# EAGLE design adapter-board-controller (EAGLE 7.6.0)
ADAPTER-BOARD-CONTROLLER
AUTHOR: lokies; COMPANY: Max-Planck-Institut für Gravitationsphysik; CREATIONAUTHOR: lokies; CREATIONDATE: 2026-02-05; INFOSETTINGS: Used by 'info.ulp' - do not edit manually! |FileTime=2026-02-05, 14:04:26|FileVersion=2||[FrontMatter]|DocTitle=|SubTitle=|Authors=|Keywords=|Abstract=|LaTeXSyntax=0||[Safety]|VoltageHazard=-1|HeatHazard=-1|Convection=0|ForcedAir=0|WaterCooling=0|LightHazard=-1|LaserPower=1000|LaserWavelength=1064|LaserClass=6|LightPower=1000|LightInvisible=0||[Notes]|Machinery=-1|IntendedUsers=-1|; REVISION: 2026-02-05; TITLE: ADAPTER-BOARD-CONTROLLER; TITLE1: ADAPTER-BOARD-; TITLE2: CONTROLLER
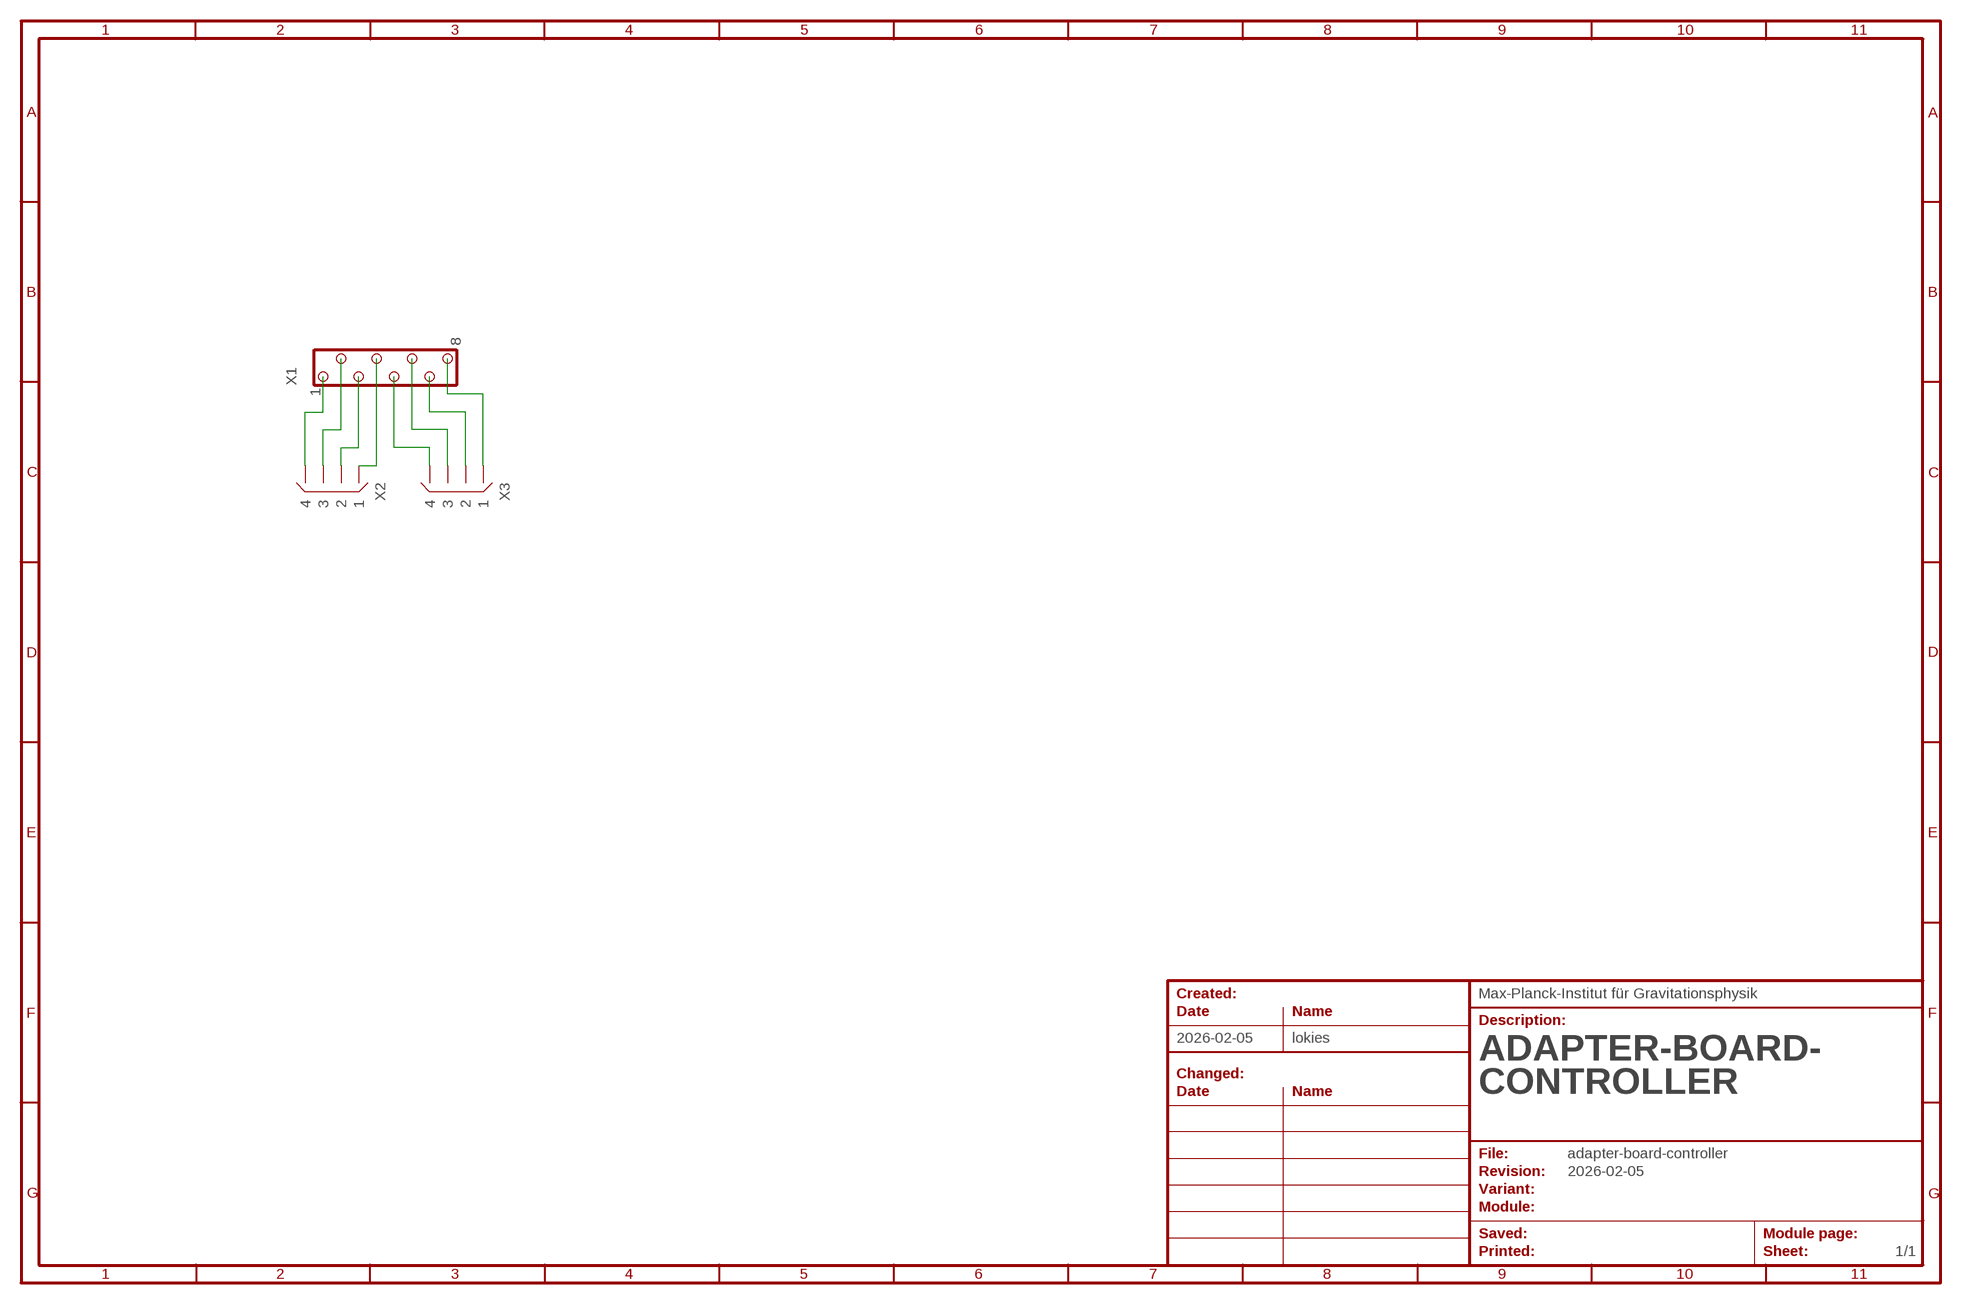
[diagram p0: schematic, sheet 1]
$1 (FRAME-A4-LANDSCAPE): SPICE: <ignore>

## Parts
X1  XS08-RJ45  [XS08-2S-RJ45]
X2  X04  [X04-SIL-MALE-VERT-L]
X3  X04  [X04-SIL-MALE-VERT-L]

## Nets
N$1: X1.4 X2.1
N$2: X1.3 X2.2
N$3: X1.2 X2.3
N$4: X1.1 X2.4
N$5: X1.5 X3.4
N$6: X1.6 X3.3
N$7: X1.7 X3.2
N$8: X1.8 X3.1
Unconnected: X1.GND1(CASE) X1.GND2(CASE)

## Library data of the parts
X1 = connectors:XS08: Shielded connector, 8 pins, 2 shield pins; IGNOREVALUE: 1; SPICE: <ignore>
X2 X3 = connectors:X04: Connector 4 pins; IGNOREVALUE: 1; SPICE: <ignore>

## Board
ADAPTER-BOARD-CONTROLLER
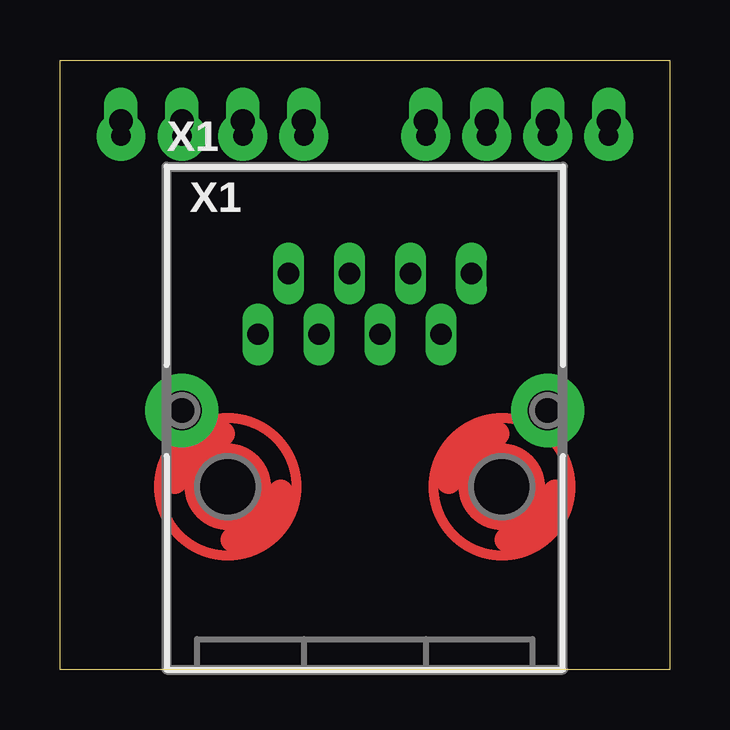
[diagram p1: board, top side]
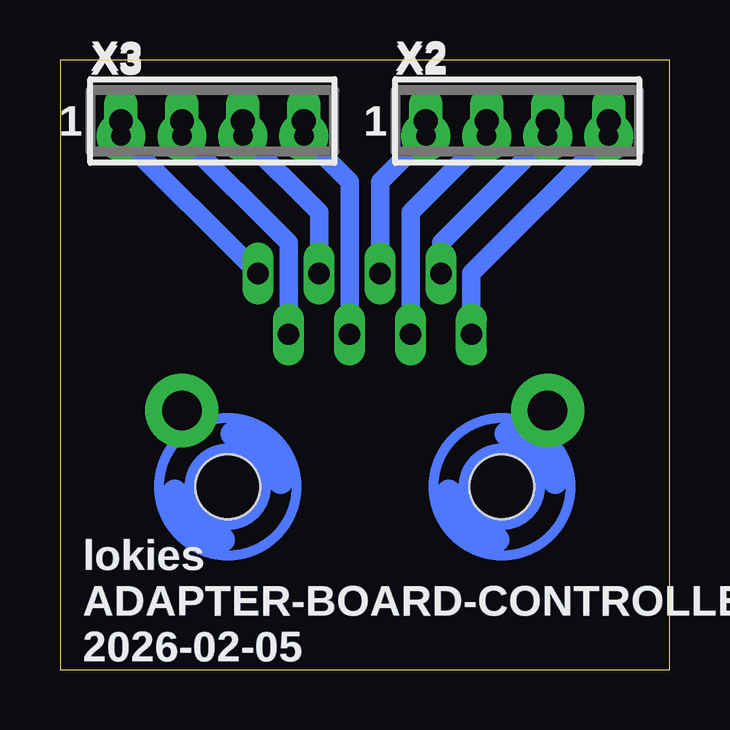
[diagram p2: board, bottom side, seen from below]

Size 25.4 x 25.4 mm. Coordinates in mm from the lower left corner, seen from the top.
Outline: 0,0 0,25.4 25.4,25.4 25.4,0 0,0
Copper layers (1*16): Top 0.035mm / dielectric 1.5mm / Bottom 0.035mm
Design rules "doublesided-inhouse": minimum track width 0.2mm, minimum drill 0.8mm, track to track 0.2mm, track to pad 0.2mm, pad to pad 0.2mm, via to via 0.2mm, smd to smd 0mil, copper to edge 0.5mm, drill to drill 0.4mm, minimum pad ring 0.2mm, minimum via ring 0.2mm, stop-mask expansion 0.05mm, vias tented up to drill 0mil, thermal gap 0.2mm

### Footprints (pad centres in the part's own frame; a part is rotated, then mirrored left to right if it is on the bottom)
XS08-2S-RJ45 = drill 0.889 pad 1.27 long: 1 -4.445,-1.27; 2 -3.175,1.27; 3 -1.905,-1.27; 4 -0.635,1.27; 5 0.635,-1.27; 6 1.905,1.27; 7 3.175,-1.27; 8 4.445,1.27 | drill 1.651 pad 3.048: GND1 -7.62,-4.445; GND2 7.62,-4.445 | hole 2.692: -5.715,-7.62; 5.715,-7.62
X04-SIL-MALE-VERT-L = drill 0.991 pad 1.397 long: 1 -3.81,0; 2 -1.27,0; 3 1.27,0; 4 3.81,0

### Placement (x,y rotation side)
U$2  [INFO-SMALL]  24.45,2.86 0 bottom
X1  12.7,15.24 0 top
X2  6.35,22.86 0 bottom
X3  19.05,22.86 0 bottom

### Tracks (layer width: path | path; a pad name or v marks a point on that pad's centre or on a via)
N$1  (via drill 0.81 pad 2.03)
  Top 0.762: X2.1 v10.16,22.23
  Bottom 0.762: v10.16,22.23 12.06,20.32 X1.4
N$2  (via drill 0.81 pad 2.03)
  Top 0.762: X2.2 v7.62,22.23
  Bottom 0.762: v7.62,22.23 10.79,19.05 X1.3
N$3  (via drill 0.81 pad 2.03)
  Top 0.762: X2.3 v5.08,22.23
  Bottom 0.762: v5.08,22.23 9.52,17.78 X1.2
N$4  (via drill 0.81 pad 2.03)
  Top 0.762: X2.4 v2.54,22.23
  Bottom 0.762: v2.54,22.23 8.25,16.51 X1.1
N$5  (via drill 0.81 pad 2.03)
  Top 0.762: X3.4 v15.24,22.23
  Bottom 0.762: v15.24,22.23 13.33,20.32 X1.5
N$6  (via drill 0.81 pad 2.03)
  Top 0.762: X3.3 v17.78,22.23
  Bottom 0.762: v17.78,22.23 14.6,19.05 X1.6
N$7  (via drill 0.81 pad 2.03)
  Top 0.762: X3.2 v20.32,22.23
  Bottom 0.762: v20.32,22.23 15.88,17.78 X1.7
N$8  (via drill 0.81 pad 2.03)
  Top 0.762: X3.1 v22.86,22.23
  Bottom 0.762: v22.86,22.23 X1.8